# Altium schematic sheet 3_waffling60-BAK_mcu.SchDoc: =ProjectTitle
size A4; Address1: github.com/4pplet/waffling60; Address2: Licence: CERN-OHL-S; SheetNumber: 3; SheetTotal: 3
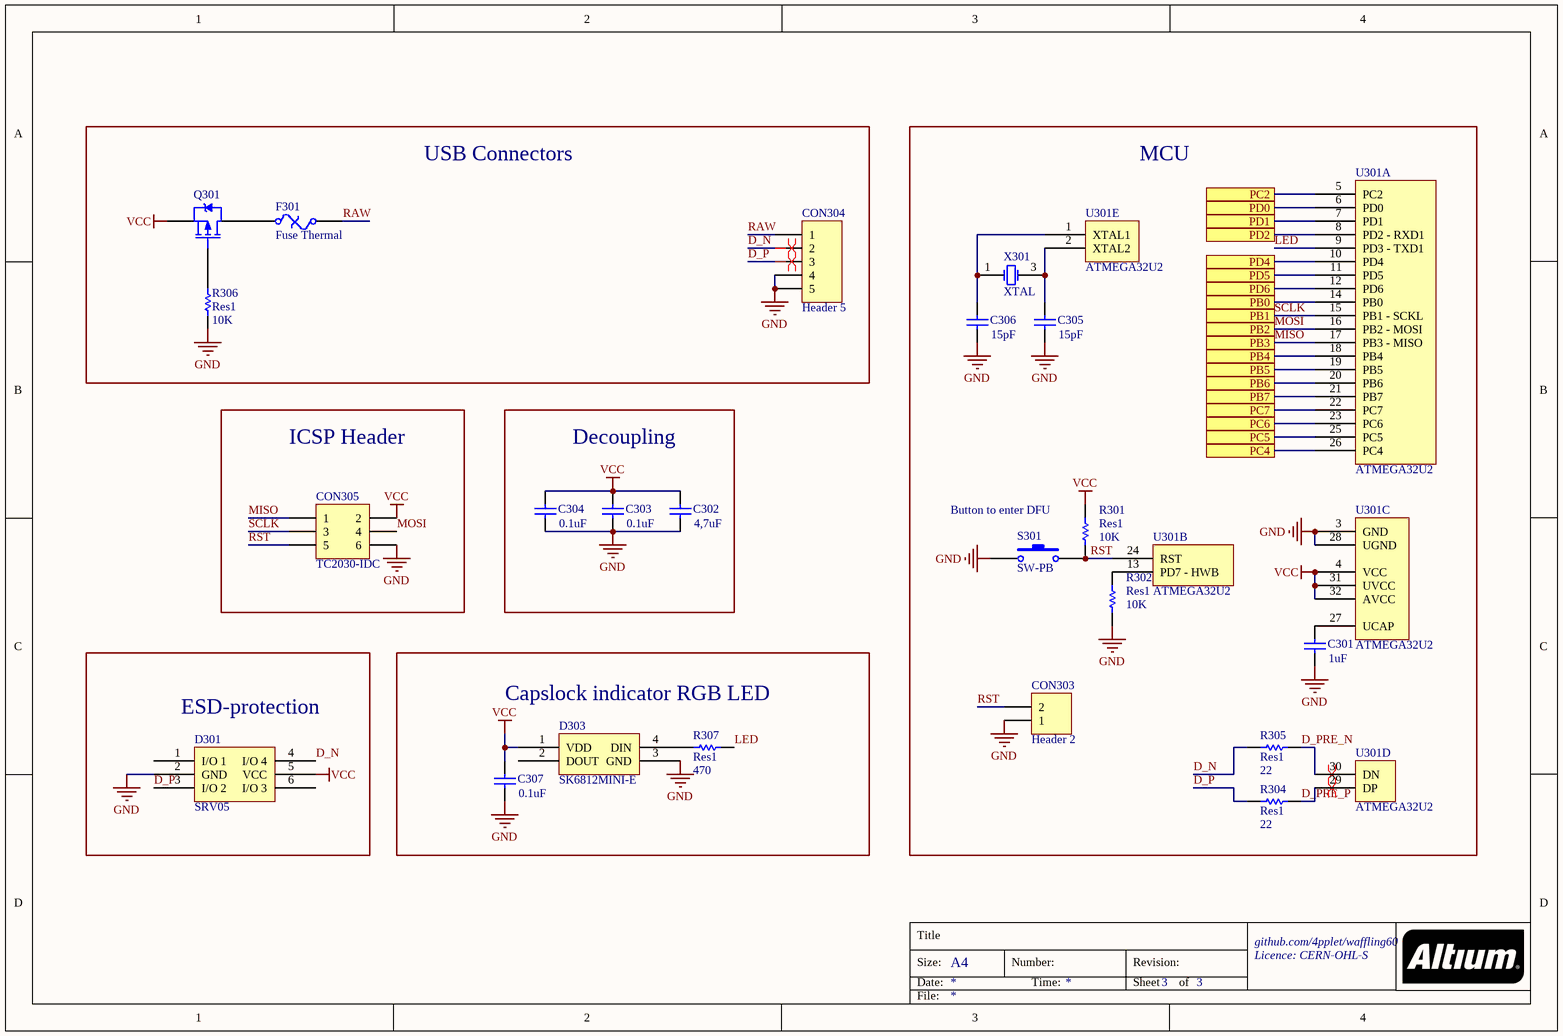
[diagram p0: 3_waffling60-BAK_mcu.SchDoc]

## Parts
C301  value 1uF  [C0603[1608]]
C302  value 4,7uF  [C0603[1608]]
C303  value 0.1uF  [C0603[1608]]
C304  value 0.1uF  [C0603[1608]]
C305  value 15pF  [C0603[1608]]
C306  value 15pF  [C0603[1608]]
C307  value 0.1uF  [C0603[1608]]
CON303  Header 2  [HDR1X2]  (no BOM)
CON304  Header 5  [JST SM04B-SRSS-TB]
CON305  TC2030-IDC  [TC2030-IDC-NL]  (no BOM)
D301  SRV05  [SOT-23-6]
D303  SK6812MINI-E  [SK6812MINI-E]
F301  Fuse Thermal  [C1206[3216]]
Q301  PMOS-2  [SOT-23-3]  (value not drawn)
R301  Res1  value 10K  [R0603[1608]]
R302  Res1  value 10K  [R0603[1608]]
R304  Res1  value 22  [R0603[1608]]
R305  Res1  value 22  [R0603[1608]]
R306  Res1  value 10K  [R0603[1608]]
R307  Res1  value 470  [R0603[1608]]
S301  SW-PB  [Combo switch]
U301  ATMEGA32U2  [ATMEGA32U2-COMBO]  (parts A,B,C,D,E of 5)
X301  XTAL  [XTAL-3225]

## Blocks framed on the sheet
USB Connectors: CON304 F301 Q301 R306
MCU: C301 C305 C306 CON303 R301 R302 R304 R305 S301 U301 X301
ICSP Header: CON305
Decoupling: C302-C304
ESD-protection: D301
Capslock indicator RGB LED: C307 D303 R307

## Ports
PB0, PB1, PB2, PB3, PB4, PB5, PB6, PB7, PC2, PC4, PC5, PC6, PC7, PD0, PD1, PD2, PD4, PD5, PD6

## Nets
GND: C301.1 C302.1 C303.1 C304.1 C305.1 C306.1 C307.1 CON303.1 CON304.4 CON304.5 CON305.6 D301.2(GND) D303.3(GND) R302.2 R306.2 S301.1 U301.3(GND) U301.28(UGND) X301.2(GND) X301.4(GND)
VCC: C302.2 C303.2 C304.2 C307.2 CON305.2 D301.5(VCC) D303.1(VDD) Q301.2(S) R301.1 U301.4(VCC) U301.31(UVCC) U301.32(AVCC)
D_N: CON304.2 D301.4(I/O_4) R305.2
D_P: CON304.3 D301.3(I/O_2) R304.2
D_PRE_N: R305.1 U301.30(DN)
D_PRE_P: R304.1 U301.29(DP)
LED: R307.2 U301.9(PD3_-_TXD1)
MISO: CON305.1 U301.17(PB3_-_MISO) ; port PB3
MOSI: CON305.4 U301.16(PB2_-_MOSI) ; port PB2
PB0: U301.14(PB0) ; port PB0
PB4: U301.18(PB4) ; port PB4
PB5: U301.19(PB5) ; port PB5
PB6: U301.20(PB6) ; port PB6
PB7: U301.21(PB7) ; port PB7
PC2: U301.5(PC2) ; port PC2
PC4: U301.26(PC4) ; port PC4
PC5: U301.25(PC5) ; port PC5
PC6: U301.23(PC6) ; port PC6
PC7: U301.22(PC7) ; port PC7
PD0: U301.6(PD0) ; port PD0
PD1: U301.7(PD1) ; port PD1
PD2: U301.8(PD2_-_RXD1) ; port PD2
PD4: U301.10(PD4) ; port PD4
PD5: U301.11(PD5) ; port PD5
PD6: U301.12(PD6) ; port PD6
RAW: CON304.1 F301.2
RST: CON303.2 CON305.5 R301.2 S301.2 U301.24(RST)
SCLK: CON305.3 U301.15(PB1_-_SCKL) ; port PB1
NetC301_2: C301.2 U301.27(UCAP)
NetC305_2: C305.2 U301.2(XTAL2) X301.3(OSC2)
NetC306_2: C306.2 U301.1(XTAL1) X301.1(OSC1)
NetD303_4: D303.4(DIN) R307.1
NetF301_1: F301.1 Q301.3(D)
NetQ301_1: Q301.1(G) R306.1
NetR302_1: R302.1 U301.13(PD7_-_HWB)

Not connected (* = marked no-connect by the designer): D301 1(I/O_1) 6(I/O_3); D303 2(DOUT)

## Layout directives
differential pair: D_N, D_P, D_PRE_N, D_PRE_P

## Notes on the sheet
- (near R301) Button to enter DFU
- Title
- Size:
- Date:
- A4
- Number:
- Time:
- Revision:
- Sheet
- of
- File:

## Library data of the parts
C301 = Cap: Capacitor; MRF.Part: CL10A105KB8NNNC; MFG: KEMET; MFGPN: C0603C104M5RACTU; LCSC MFG: Samsung Electro-Mechanics; Version: 0603 imperial; LCSC Part #: C15849
C302 = Cap: Capacitor; MRF.Part: CL10A475KO8NNNC; LCSC MFG: Samsung Electro-Mechanics; LCSC Part #: C19666
C303 C304 C307 = Cap: Capacitor; MRF.Part: CC0603KRX7R9BB104; MFG: KEMET; MFGPN: C0603C104M5RACTU; LCSC MFG: YAGEO; Version: 0603 imperial; LCSC Part #: C14663
C305 C306 = Cap: Capacitor; MRF.Part: CL10C150JB8NNNC; LCSC MFG: Samsung Electro-Mechanics; Version: 0603 imperial; LCSC Part #: C1644
CON303 = Header 2: Header, 2-Pin
CON304 = Header 5: JST for USB daughter board; MFGPN: SM04B-SRSS-TB(LF)(SN); MFG: JST Sales America Inc.; LCSC MFG: JST Sales America; LCSC Part #: C160404; MRF.Part: SM04B-SRSS-TB(LF)(SN)
CON305 = Header 3X2: TagConnect header
D301 = SRV05: MRF.Part: SRV05-4-P-T7; LCSC MFG: ProTek Devices; LCSC Part #: C85364
D303 = SK6812MINI-E: MRF.Part: DY-S352818/RGBC/6812-2T; LCSC MFG: TONYU; LCSC Part #: C524051
F301 = Fuse Thermal: Thermal Fuse; MRF.Part: ASMD1206-050; MFG: Bel Fuse Inc.; MFGPN: 0ZCJ0050FF2G; LCSC MFG: Shenzhen JDT Fuse; LCSC Part #: C135338
Q301 = PMOS-2: P-Channel Power MOSFET; MRF.Part: SI2301CDS-T1-GE3; LCSC MFG: Vishay Intertech; LCSC Part #: C10487; Version: SOT23-3
R301 R302 R306 = Res1: Resistor; MRF.Part: 0603WAF1002T5E; MFG: Panasonic Electronic Components; MFGPN: ERJ-3EKF5101V; LCSC MFG: Uniroyal Elec; Version: 0603 imperial; LCSC Part #: C25804
R304 R305 = Res1: Resistor; MRF.Part: 0603WAF220JT5E; MFG: Panasonic Electronic Components; MFGPN: ERJ-3EKF5101V; LCSC MFG: Uniroyal Elec; Version: 0603 imperial; LCSC Part #: C23345
R307 = Res1: Resistor; MRF.Part: 0603WAF4700T5E; MFG: Panasonic Electronic Components; MFGPN: ERJ-3EKF5101V; LCSC MFG: UNI-ROYAL(Uniroyal Elec); Version: 0603 imperial; LCSC Part #: C23179
S301 = SW-PB: Switch; MRF.Part: TS-1187A-C-D-B; MFGPN: PTS645SM43SMTR92 LFS; MFG: C&K; LCSC MFG: XKB Enterprise; LCSC Part #: C318888
U301 = ATMEGA32U2: MRF.Part: ATMEGA32U2-MU; MFG: Microchip Technology; MFGPN: ATMEGA32U2-AUR; LCSC MFG: Microchip Tech; LCSC Part #: C57345
X301 = XTAL: Crystal Oscillator; MRF.Part: X322516MLB4SI; LCSC MFG: Yangxing Tech; LCSC Part #: C13738